# EAGLE board 11-de-7 (EAGLE 6.6.0)
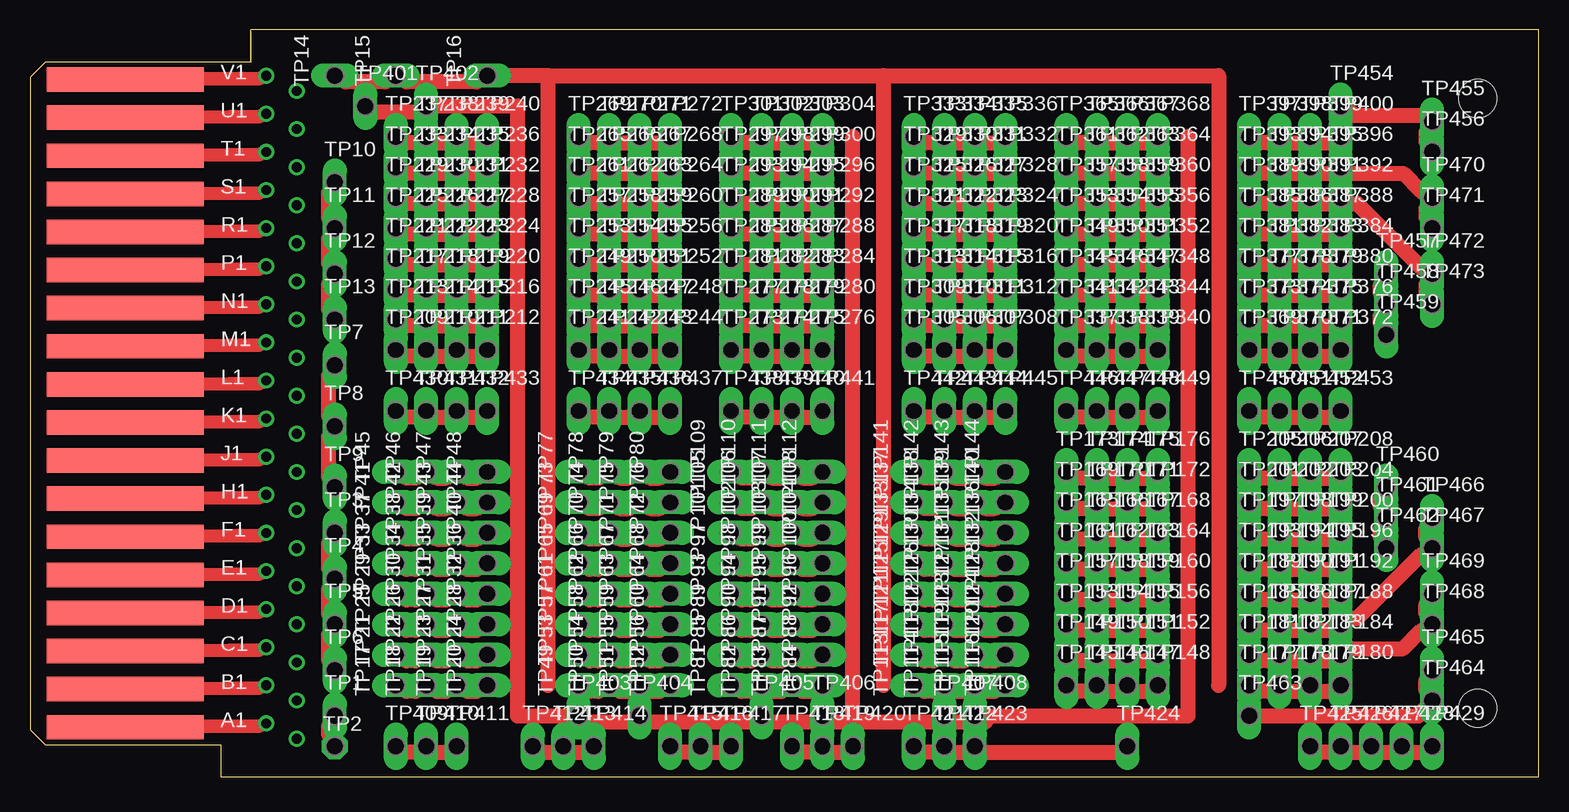
[diagram p1: board, top side]
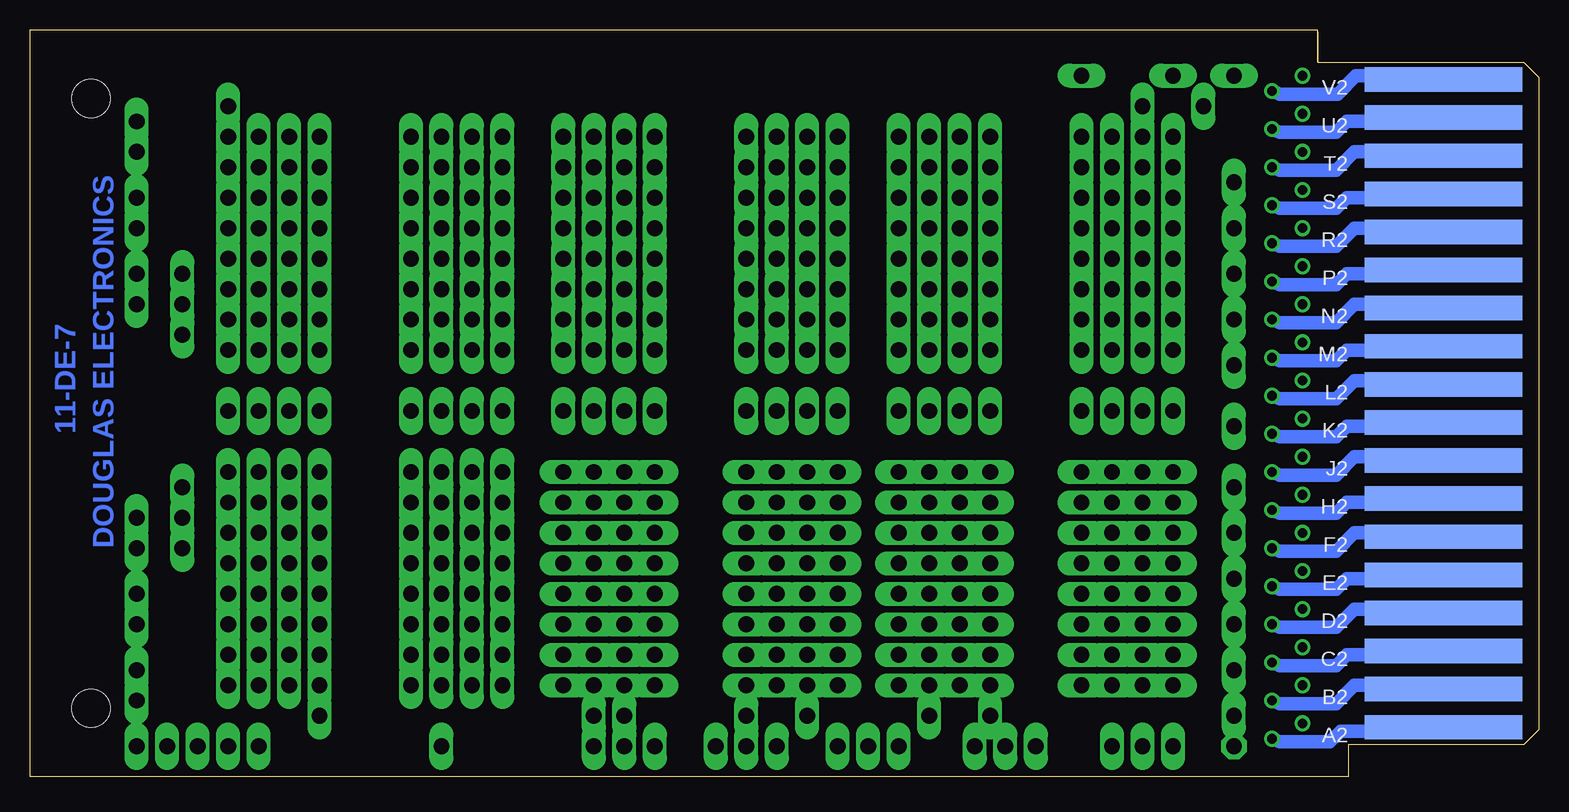
[diagram p2: board, bottom side, seen from below]

Size 125.73 x 62.23 mm. Coordinates in mm from the lower left corner, seen from the top.
Copper layers (1+16): Top 0.035mm / dielectric 1.5mm / Bottom 0.035mm
Design rules "16mils": minimum track width 16mil, minimum drill 32mil, track to track 15mil, track to pad 10mil, pad to pad 10mil, via to via 10mil, smd to smd 10mil, copper to edge 13mil, drill to drill 10mil, minimum pad ring 10mil, minimum via ring 8mil, stop-mask expansion 0mil, vias tented up to drill 0mil, thermal gap 10mil
Net classes: 0 default: width 1.143 mm

## Footprints (pad centres in the part's own frame; a part is rotated, then mirrored left to right if it is on the bottom)
P1-13Y = drill 1.321 pad 1.905 long: TP 0,0
P1-13 = drill 1.321 pad 2.159 octagon: TP 0,0
EDGE-CON2 = smd 13.106 x 2.032: A1 7.938,4.128; B1 7.938,7.303; C1 7.938,10.477; D1 7.938,13.652; E1 7.938,16.828; F1 7.938,20.003; H1 7.938,23.177; J1 7.938,26.352; K1 7.938,29.527; L1 7.938,32.703; M1 7.938,35.877; N1 7.938,39.053; P1 7.938,42.227; R1 7.938,45.403; S1 7.938,48.578; T1 7.938,51.752; U1 7.938,54.928; V1 7.938,58.102 | smd 13.106 x 2.032 bottom: A2 7.938,4.128; B2 7.938,7.303; C2 7.938,10.477; D2 7.938,13.652; E2 7.938,16.828; F2 7.938,20.003; H2 7.938,23.177; J2 7.938,26.352; K2 7.938,29.527; L2 7.938,32.703; M2 7.938,35.877; N2 7.938,39.053; P2 7.938,42.227; R2 7.938,45.403; S2 7.938,48.578; T2 7.938,51.752; U2 7.938,54.928; V2 7.938,58.102
SINGLE = hole 3.175: 120.65,56.515; 120.65,5.715
THRU-HOLEC = drill 0.813 pad 1.27: A1 17.78,3.81; A2 20.32,2.54; B1 17.78,6.985; B2 20.32,5.715; C1 17.78,10.16; C2 20.32,8.89; D1 17.78,13.335; D2 20.32,12.065; E1 17.78,16.51; E2 20.32,15.24; F1 17.78,19.685; F2 20.32,18.415; H1 17.78,22.86; H2 20.32,21.59; J1 17.78,26.035; J2 20.32,24.765; K1 17.78,29.21; K2 20.32,27.94; L1 17.78,32.385; L2 20.32,31.115; M1 17.78,35.56; M2 20.32,34.29; N1 17.78,38.735; N2 20.32,37.465; P1 17.78,41.91; P2 20.32,40.64; R1 17.78,45.085; R2 20.32,43.815; S1 17.78,48.26; S2 20.32,46.99; T1 17.78,51.435; T2 20.32,50.165; U1 17.78,54.61; U2 20.32,53.34; V1 17.78,57.785; V2 20.32,56.515

## Placement (x,y rotation side)
TP1  TPPAD1-13Y  [P1-13Y]  25.4,5.08 0 top
TP2  TPPAD1-13  [P1-13]  25.4,2.54 0 top
TP3  TPPAD1-13Y  [P1-13Y]  25.4,20.32 0 top
TP4  TPPAD1-13Y  [P1-13Y]  25.4,16.51 0 top
TP5  TPPAD1-13Y  [P1-13Y]  25.4,12.7 0 top
TP6  TPPAD1-13Y  [P1-13Y]  25.4,8.89 0 top
TP7  TPPAD1-13Y  [P1-13Y]  25.4,34.29 0 top
TP8  TPPAD1-13Y  [P1-13Y]  25.4,29.21 0 top
TP9  TPPAD1-13Y  [P1-13Y]  25.4,24.13 0 top
TP10  TPPAD1-13Y  [P1-13Y]  25.4,49.53 0 top
TP11  TPPAD1-13Y  [P1-13Y]  25.4,45.72 0 top
TP12  TPPAD1-13Y  [P1-13Y]  25.4,41.91 0 top
TP13  TPPAD1-13Y  [P1-13Y]  25.4,38.1 0 top
TP14  TPPAD1-13Y  [P1-13Y]  25.4,58.42 90 top
TP15  TPPAD1-13Y  [P1-13Y]  30.48,58.42 90 top
TP16  TPPAD1-13Y  [P1-13Y]  38.1,58.42 90 top
TP17  TPPAD1-13Y  [P1-13Y]  30.48,7.62 90 top
TP18  TPPAD1-13Y  [P1-13Y]  33.02,7.62 90 top
TP19  TPPAD1-13Y  [P1-13Y]  35.56,7.62 90 top
TP20  TPPAD1-13Y  [P1-13Y]  38.1,7.62 90 top
TP21  TPPAD1-13Y  [P1-13Y]  30.48,10.16 90 top
TP22  TPPAD1-13Y  [P1-13Y]  33.02,10.16 90 top
TP23  TPPAD1-13Y  [P1-13Y]  35.56,10.16 90 top
TP24  TPPAD1-13Y  [P1-13Y]  38.1,10.16 90 top
TP25  TPPAD1-13Y  [P1-13Y]  30.48,12.7 90 top
TP26  TPPAD1-13Y  [P1-13Y]  33.02,12.7 90 top
TP27  TPPAD1-13Y  [P1-13Y]  35.56,12.7 90 top
TP28  TPPAD1-13Y  [P1-13Y]  38.1,12.7 90 top
TP29  TPPAD1-13Y  [P1-13Y]  30.48,15.24 90 top
TP30  TPPAD1-13Y  [P1-13Y]  33.02,15.24 90 top
TP31  TPPAD1-13Y  [P1-13Y]  35.56,15.24 90 top
TP32  TPPAD1-13Y  [P1-13Y]  38.1,15.24 90 top
TP33  TPPAD1-13Y  [P1-13Y]  30.48,17.78 90 top
TP34  TPPAD1-13Y  [P1-13Y]  33.02,17.78 90 top
TP35  TPPAD1-13Y  [P1-13Y]  35.56,17.78 90 top
TP36  TPPAD1-13Y  [P1-13Y]  38.1,17.78 90 top
TP37  TPPAD1-13Y  [P1-13Y]  30.48,20.32 90 top
TP38  TPPAD1-13Y  [P1-13Y]  33.02,20.32 90 top
TP39  TPPAD1-13Y  [P1-13Y]  35.56,20.32 90 top
TP40  TPPAD1-13Y  [P1-13Y]  38.1,20.32 90 top
TP41  TPPAD1-13Y  [P1-13Y]  30.48,22.86 90 top
TP42  TPPAD1-13Y  [P1-13Y]  33.02,22.86 90 top
TP43  TPPAD1-13Y  [P1-13Y]  35.56,22.86 90 top
TP44  TPPAD1-13Y  [P1-13Y]  38.1,22.86 90 top
TP45  TPPAD1-13Y  [P1-13Y]  30.48,25.4 90 top
TP46  TPPAD1-13Y  [P1-13Y]  33.02,25.4 90 top
TP47  TPPAD1-13Y  [P1-13Y]  35.56,25.4 90 top
TP48  TPPAD1-13Y  [P1-13Y]  38.1,25.4 90 top
TP49  TPPAD1-13Y  [P1-13Y]  45.72,7.62 90 top
TP50  TPPAD1-13Y  [P1-13Y]  48.26,7.62 90 top
TP51  TPPAD1-13Y  [P1-13Y]  50.8,7.62 90 top
TP52  TPPAD1-13Y  [P1-13Y]  53.34,7.62 90 top
TP53  TPPAD1-13Y  [P1-13Y]  45.72,10.16 90 top
TP54  TPPAD1-13Y  [P1-13Y]  48.26,10.16 90 top
TP55  TPPAD1-13Y  [P1-13Y]  50.8,10.16 90 top
TP56  TPPAD1-13Y  [P1-13Y]  53.34,10.16 90 top
TP57  TPPAD1-13Y  [P1-13Y]  45.72,12.7 90 top
TP58  TPPAD1-13Y  [P1-13Y]  48.26,12.7 90 top
TP59  TPPAD1-13Y  [P1-13Y]  50.8,12.7 90 top
TP60  TPPAD1-13Y  [P1-13Y]  53.34,12.7 90 top
TP61  TPPAD1-13Y  [P1-13Y]  45.72,15.24 90 top
TP62  TPPAD1-13Y  [P1-13Y]  48.26,15.24 90 top
TP63  TPPAD1-13Y  [P1-13Y]  50.8,15.24 90 top
TP64  TPPAD1-13Y  [P1-13Y]  53.34,15.24 90 top
TP65  TPPAD1-13Y  [P1-13Y]  45.72,17.78 90 top
TP66  TPPAD1-13Y  [P1-13Y]  48.26,17.78 90 top
TP67  TPPAD1-13Y  [P1-13Y]  50.8,17.78 90 top
TP68  TPPAD1-13Y  [P1-13Y]  53.34,17.78 90 top
TP69  TPPAD1-13Y  [P1-13Y]  45.72,20.32 90 top
TP70  TPPAD1-13Y  [P1-13Y]  48.26,20.32 90 top
TP71  TPPAD1-13Y  [P1-13Y]  50.8,20.32 90 top
TP72  TPPAD1-13Y  [P1-13Y]  53.34,20.32 90 top
TP73  TPPAD1-13Y  [P1-13Y]  45.72,22.86 90 top
TP74  TPPAD1-13Y  [P1-13Y]  48.26,22.86 90 top
TP75  TPPAD1-13Y  [P1-13Y]  50.8,22.86 90 top
TP76  TPPAD1-13Y  [P1-13Y]  53.34,22.86 90 top
TP77  TPPAD1-13Y  [P1-13Y]  45.72,25.4 90 top
TP78  TPPAD1-13Y  [P1-13Y]  48.26,25.4 90 top
TP79  TPPAD1-13Y  [P1-13Y]  50.8,25.4 90 top
TP80  TPPAD1-13Y  [P1-13Y]  53.34,25.4 90 top
TP81  TPPAD1-13Y  [P1-13Y]  58.42,7.62 90 top
TP82  TPPAD1-13Y  [P1-13Y]  60.96,7.62 90 top
TP83  TPPAD1-13Y  [P1-13Y]  63.5,7.62 90 top
TP84  TPPAD1-13Y  [P1-13Y]  66.04,7.62 90 top
TP85  TPPAD1-13Y  [P1-13Y]  58.42,10.16 90 top
TP86  TPPAD1-13Y  [P1-13Y]  60.96,10.16 90 top
TP87  TPPAD1-13Y  [P1-13Y]  63.5,10.16 90 top
TP88  TPPAD1-13Y  [P1-13Y]  66.04,10.16 90 top
TP89  TPPAD1-13Y  [P1-13Y]  58.42,12.7 90 top
TP90  TPPAD1-13Y  [P1-13Y]  60.96,12.7 90 top
TP91  TPPAD1-13Y  [P1-13Y]  63.5,12.7 90 top
TP92  TPPAD1-13Y  [P1-13Y]  66.04,12.7 90 top
TP93  TPPAD1-13Y  [P1-13Y]  58.42,15.24 90 top
TP94  TPPAD1-13Y  [P1-13Y]  60.96,15.24 90 top
TP95  TPPAD1-13Y  [P1-13Y]  63.5,15.24 90 top
TP96  TPPAD1-13Y  [P1-13Y]  66.04,15.24 90 top
TP97  TPPAD1-13Y  [P1-13Y]  58.42,17.78 90 top
TP98  TPPAD1-13Y  [P1-13Y]  60.96,17.78 90 top
TP99  TPPAD1-13Y  [P1-13Y]  63.5,17.78 90 top
TP100  TPPAD1-13Y  [P1-13Y]  66.04,17.78 90 top
TP101  TPPAD1-13Y  [P1-13Y]  58.42,20.32 90 top
TP102  TPPAD1-13Y  [P1-13Y]  60.96,20.32 90 top
TP103  TPPAD1-13Y  [P1-13Y]  63.5,20.32 90 top
TP104  TPPAD1-13Y  [P1-13Y]  66.04,20.32 90 top
TP105  TPPAD1-13Y  [P1-13Y]  58.42,22.86 90 top
TP106  TPPAD1-13Y  [P1-13Y]  60.96,22.86 90 top
TP107  TPPAD1-13Y  [P1-13Y]  63.5,22.86 90 top
TP108  TPPAD1-13Y  [P1-13Y]  66.04,22.86 90 top
TP109  TPPAD1-13Y  [P1-13Y]  58.42,25.4 90 top
TP110  TPPAD1-13Y  [P1-13Y]  60.96,25.4 90 top
TP111  TPPAD1-13Y  [P1-13Y]  63.5,25.4 90 top
TP112  TPPAD1-13Y  [P1-13Y]  66.04,25.4 90 top
TP113  TPPAD1-13Y  [P1-13Y]  73.66,7.62 90 top
TP114  TPPAD1-13Y  [P1-13Y]  76.2,7.62 90 top
TP115  TPPAD1-13Y  [P1-13Y]  78.74,7.62 90 top
TP116  TPPAD1-13Y  [P1-13Y]  81.28,7.62 90 top
TP117  TPPAD1-13Y  [P1-13Y]  73.66,10.16 90 top
TP118  TPPAD1-13Y  [P1-13Y]  76.2,10.16 90 top
TP119  TPPAD1-13Y  [P1-13Y]  78.74,10.16 90 top
TP120  TPPAD1-13Y  [P1-13Y]  81.28,10.16 90 top
TP121  TPPAD1-13Y  [P1-13Y]  73.66,12.7 90 top
TP122  TPPAD1-13Y  [P1-13Y]  76.2,12.7 90 top
TP123  TPPAD1-13Y  [P1-13Y]  78.74,12.7 90 top
TP124  TPPAD1-13Y  [P1-13Y]  81.28,12.7 90 top
TP125  TPPAD1-13Y  [P1-13Y]  73.66,15.24 90 top
TP126  TPPAD1-13Y  [P1-13Y]  76.2,15.24 90 top
TP127  TPPAD1-13Y  [P1-13Y]  78.74,15.24 90 top
TP128  TPPAD1-13Y  [P1-13Y]  81.28,15.24 90 top
TP129  TPPAD1-13Y  [P1-13Y]  73.66,17.78 90 top
TP130  TPPAD1-13Y  [P1-13Y]  76.2,17.78 90 top
TP131  TPPAD1-13Y  [P1-13Y]  78.74,17.78 90 top
TP132  TPPAD1-13Y  [P1-13Y]  81.28,17.78 90 top
TP133  TPPAD1-13Y  [P1-13Y]  73.66,20.32 90 top
TP134  TPPAD1-13Y  [P1-13Y]  76.2,20.32 90 top
TP135  TPPAD1-13Y  [P1-13Y]  78.74,20.32 90 top
TP136  TPPAD1-13Y  [P1-13Y]  81.28,20.32 90 top
TP137  TPPAD1-13Y  [P1-13Y]  73.66,22.86 90 top
TP138  TPPAD1-13Y  [P1-13Y]  76.2,22.86 90 top
TP139  TPPAD1-13Y  [P1-13Y]  78.74,22.86 90 top
TP140  TPPAD1-13Y  [P1-13Y]  81.28,22.86 90 top
TP141  TPPAD1-13Y  [P1-13Y]  73.66,25.4 90 top
TP142  TPPAD1-13Y  [P1-13Y]  76.2,25.4 90 top
TP143  TPPAD1-13Y  [P1-13Y]  78.74,25.4 90 top
TP144  TPPAD1-13Y  [P1-13Y]  81.28,25.4 90 top
TP145  TPPAD1-13Y  [P1-13Y]  86.36,7.62 0 top
TP146  TPPAD1-13Y  [P1-13Y]  88.9,7.62 0 top
TP147  TPPAD1-13Y  [P1-13Y]  91.44,7.62 0 top
TP148  TPPAD1-13Y  [P1-13Y]  93.98,7.62 0 top
TP149  TPPAD1-13Y  [P1-13Y]  86.36,10.16 0 top
TP150  TPPAD1-13Y  [P1-13Y]  88.9,10.16 0 top
TP151  TPPAD1-13Y  [P1-13Y]  91.44,10.16 0 top
TP152  TPPAD1-13Y  [P1-13Y]  93.98,10.16 0 top
TP153  TPPAD1-13Y  [P1-13Y]  86.36,12.7 0 top
TP154  TPPAD1-13Y  [P1-13Y]  88.9,12.7 0 top
TP155  TPPAD1-13Y  [P1-13Y]  91.44,12.7 0 top
TP156  TPPAD1-13Y  [P1-13Y]  93.98,12.7 0 top
TP157  TPPAD1-13Y  [P1-13Y]  86.36,15.24 0 top
TP158  TPPAD1-13Y  [P1-13Y]  88.9,15.24 0 top
TP159  TPPAD1-13Y  [P1-13Y]  91.44,15.24 0 top
TP160  TPPAD1-13Y  [P1-13Y]  93.98,15.24 0 top
TP161  TPPAD1-13Y  [P1-13Y]  86.36,17.78 0 top
TP162  TPPAD1-13Y  [P1-13Y]  88.9,17.78 0 top
TP163  TPPAD1-13Y  [P1-13Y]  91.44,17.78 0 top
TP164  TPPAD1-13Y  [P1-13Y]  93.98,17.78 0 top
TP165  TPPAD1-13Y  [P1-13Y]  86.36,20.32 0 top
TP166  TPPAD1-13Y  [P1-13Y]  88.9,20.32 0 top
TP167  TPPAD1-13Y  [P1-13Y]  91.44,20.32 0 top
TP168  TPPAD1-13Y  [P1-13Y]  93.98,20.32 0 top
TP169  TPPAD1-13Y  [P1-13Y]  86.36,22.86 0 top
TP170  TPPAD1-13Y  [P1-13Y]  88.9,22.86 0 top
TP171  TPPAD1-13Y  [P1-13Y]  91.44,22.86 0 top
TP172  TPPAD1-13Y  [P1-13Y]  93.98,22.86 0 top
TP173  TPPAD1-13Y  [P1-13Y]  86.36,25.4 0 top
TP174  TPPAD1-13Y  [P1-13Y]  88.9,25.4 0 top
TP175  TPPAD1-13Y  [P1-13Y]  91.44,25.4 0 top
TP176  TPPAD1-13Y  [P1-13Y]  93.98,25.4 0 top
TP177  TPPAD1-13Y  [P1-13Y]  101.6,7.62 0 top
TP178  TPPAD1-13Y  [P1-13Y]  104.14,7.62 0 top
TP179  TPPAD1-13Y  [P1-13Y]  106.68,7.62 0 top
TP180  TPPAD1-13Y  [P1-13Y]  109.22,7.62 0 top
TP181  TPPAD1-13Y  [P1-13Y]  101.6,10.16 0 top
TP182  TPPAD1-13Y  [P1-13Y]  104.14,10.16 0 top
TP183  TPPAD1-13Y  [P1-13Y]  106.68,10.16 0 top
TP184  TPPAD1-13Y  [P1-13Y]  109.22,10.16 0 top
TP185  TPPAD1-13Y  [P1-13Y]  101.6,12.7 0 top
TP186  TPPAD1-13Y  [P1-13Y]  104.14,12.7 0 top
TP187  TPPAD1-13Y  [P1-13Y]  106.68,12.7 0 top
TP188  TPPAD1-13Y  [P1-13Y]  109.22,12.7 0 top
TP189  TPPAD1-13Y  [P1-13Y]  101.6,15.24 0 top
TP190  TPPAD1-13Y  [P1-13Y]  104.14,15.24 0 top
TP191  TPPAD1-13Y  [P1-13Y]  106.68,15.24 0 top
TP192  TPPAD1-13Y  [P1-13Y]  109.22,15.24 0 top
TP193  TPPAD1-13Y  [P1-13Y]  101.6,17.78 0 top
TP194  TPPAD1-13Y  [P1-13Y]  104.14,17.78 0 top
TP195  TPPAD1-13Y  [P1-13Y]  106.68,17.78 0 top
TP196  TPPAD1-13Y  [P1-13Y]  109.22,17.78 0 top
TP197  TPPAD1-13Y  [P1-13Y]  101.6,20.32 0 top
TP198  TPPAD1-13Y  [P1-13Y]  104.14,20.32 0 top
TP199  TPPAD1-13Y  [P1-13Y]  106.68,20.32 0 top
TP200  TPPAD1-13Y  [P1-13Y]  109.22,20.32 0 top
TP201  TPPAD1-13Y  [P1-13Y]  101.6,22.86 0 top
TP202  TPPAD1-13Y  [P1-13Y]  104.14,22.86 0 top
TP203  TPPAD1-13Y  [P1-13Y]  106.68,22.86 0 top
TP204  TPPAD1-13Y  [P1-13Y]  109.22,22.86 0 top
TP205  TPPAD1-13Y  [P1-13Y]  101.6,25.4 0 top
TP206  TPPAD1-13Y  [P1-13Y]  104.14,25.4 0 top
TP207  TPPAD1-13Y  [P1-13Y]  106.68,25.4 0 top
TP208  TPPAD1-13Y  [P1-13Y]  109.22,25.4 0 top
TP209  TPPAD1-13Y  [P1-13Y]  30.48,35.56 0 top
TP210  TPPAD1-13Y  [P1-13Y]  33.02,35.56 0 top
TP211  TPPAD1-13Y  [P1-13Y]  35.56,35.56 0 top
TP212  TPPAD1-13Y  [P1-13Y]  38.1,35.56 0 top
TP213  TPPAD1-13Y  [P1-13Y]  30.48,38.1 0 top
TP214  TPPAD1-13Y  [P1-13Y]  33.02,38.1 0 top
TP215  TPPAD1-13Y  [P1-13Y]  35.56,38.1 0 top
TP216  TPPAD1-13Y  [P1-13Y]  38.1,38.1 0 top
TP217  TPPAD1-13Y  [P1-13Y]  30.48,40.64 0 top
TP218  TPPAD1-13Y  [P1-13Y]  33.02,40.64 0 top
TP219  TPPAD1-13Y  [P1-13Y]  35.56,40.64 0 top
TP220  TPPAD1-13Y  [P1-13Y]  38.1,40.64 0 top
TP221  TPPAD1-13Y  [P1-13Y]  30.48,43.18 0 top
TP222  TPPAD1-13Y  [P1-13Y]  33.02,43.18 0 top
TP223  TPPAD1-13Y  [P1-13Y]  35.56,43.18 0 top
TP224  TPPAD1-13Y  [P1-13Y]  38.1,43.18 0 top
TP225  TPPAD1-13Y  [P1-13Y]  30.48,45.72 0 top
TP226  TPPAD1-13Y  [P1-13Y]  33.02,45.72 0 top
TP227  TPPAD1-13Y  [P1-13Y]  35.56,45.72 0 top
TP228  TPPAD1-13Y  [P1-13Y]  38.1,45.72 0 top
TP229  TPPAD1-13Y  [P1-13Y]  30.48,48.26 0 top
TP230  TPPAD1-13Y  [P1-13Y]  33.02,48.26 0 top
TP231  TPPAD1-13Y  [P1-13Y]  35.56,48.26 0 top
TP232  TPPAD1-13Y  [P1-13Y]  38.1,48.26 0 top
TP233  TPPAD1-13Y  [P1-13Y]  30.48,50.8 0 top
TP234  TPPAD1-13Y  [P1-13Y]  33.02,50.8 0 top
TP235  TPPAD1-13Y  [P1-13Y]  35.56,50.8 0 top
TP236  TPPAD1-13Y  [P1-13Y]  38.1,50.8 0 top
TP237  TPPAD1-13Y  [P1-13Y]  30.48,53.34 0 top
TP238  TPPAD1-13Y  [P1-13Y]  33.02,53.34 0 top
TP239  TPPAD1-13Y  [P1-13Y]  35.56,53.34 0 top
TP240  TPPAD1-13Y  [P1-13Y]  38.1,53.34 0 top
TP241  TPPAD1-13Y  [P1-13Y]  45.72,35.56 0 top
TP242  TPPAD1-13Y  [P1-13Y]  48.26,35.56 0 top
TP243  TPPAD1-13Y  [P1-13Y]  50.8,35.56 0 top
TP244  TPPAD1-13Y  [P1-13Y]  53.34,35.56 0 top
TP245  TPPAD1-13Y  [P1-13Y]  45.72,38.1 0 top
TP246  TPPAD1-13Y  [P1-13Y]  48.26,38.1 0 top
TP247  TPPAD1-13Y  [P1-13Y]  50.8,38.1 0 top
TP248  TPPAD1-13Y  [P1-13Y]  53.34,38.1 0 top
TP249  TPPAD1-13Y  [P1-13Y]  45.72,40.64 0 top
TP250  TPPAD1-13Y  [P1-13Y]  48.26,40.64 0 top
TP251  TPPAD1-13Y  [P1-13Y]  50.8,40.64 0 top
TP252  TPPAD1-13Y  [P1-13Y]  53.34,40.64 0 top
TP253  TPPAD1-13Y  [P1-13Y]  45.72,43.18 0 top
TP254  TPPAD1-13Y  [P1-13Y]  48.26,43.18 0 top
TP255  TPPAD1-13Y  [P1-13Y]  50.8,43.18 0 top
TP256  TPPAD1-13Y  [P1-13Y]  53.34,43.18 0 top
TP257  TPPAD1-13Y  [P1-13Y]  45.72,45.72 0 top
TP258  TPPAD1-13Y  [P1-13Y]  48.26,45.72 0 top
TP259  TPPAD1-13Y  [P1-13Y]  50.8,45.72 0 top
TP260  TPPAD1-13Y  [P1-13Y]  53.34,45.72 0 top
TP261  TPPAD1-13Y  [P1-13Y]  45.72,48.26 0 top
TP262  TPPAD1-13Y  [P1-13Y]  48.26,48.26 0 top
TP263  TPPAD1-13Y  [P1-13Y]  50.8,48.26 0 top
TP264  TPPAD1-13Y  [P1-13Y]  53.34,48.26 0 top
TP265  TPPAD1-13Y  [P1-13Y]  45.72,50.8 0 top
TP266  TPPAD1-13Y  [P1-13Y]  48.26,50.8 0 top
TP267  TPPAD1-13Y  [P1-13Y]  50.8,50.8 0 top
TP268  TPPAD1-13Y  [P1-13Y]  53.34,50.8 0 top
TP269  TPPAD1-13Y  [P1-13Y]  45.72,53.34 0 top
TP270  TPPAD1-13Y  [P1-13Y]  48.26,53.34 0 top
TP271  TPPAD1-13Y  [P1-13Y]  50.8,53.34 0 top
TP272  TPPAD1-13Y  [P1-13Y]  53.34,53.34 0 top
TP273  TPPAD1-13Y  [P1-13Y]  58.42,35.56 0 top
TP274  TPPAD1-13Y  [P1-13Y]  60.96,35.56 0 top
TP275  TPPAD1-13Y  [P1-13Y]  63.5,35.56 0 top
TP276  TPPAD1-13Y  [P1-13Y]  66.04,35.56 0 top
TP277  TPPAD1-13Y  [P1-13Y]  58.42,38.1 0 top
TP278  TPPAD1-13Y  [P1-13Y]  60.96,38.1 0 top
TP279  TPPAD1-13Y  [P1-13Y]  63.5,38.1 0 top
TP280  TPPAD1-13Y  [P1-13Y]  66.04,38.1 0 top
TP281  TPPAD1-13Y  [P1-13Y]  58.42,40.64 0 top
TP282  TPPAD1-13Y  [P1-13Y]  60.96,40.64 0 top
TP283  TPPAD1-13Y  [P1-13Y]  63.5,40.64 0 top
TP284  TPPAD1-13Y  [P1-13Y]  66.04,40.64 0 top
TP285  TPPAD1-13Y  [P1-13Y]  58.42,43.18 0 top
TP286  TPPAD1-13Y  [P1-13Y]  60.96,43.18 0 top
TP287  TPPAD1-13Y  [P1-13Y]  63.5,43.18 0 top
TP288  TPPAD1-13Y  [P1-13Y]  66.04,43.18 0 top
TP289  TPPAD1-13Y  [P1-13Y]  58.42,45.72 0 top
TP290  TPPAD1-13Y  [P1-13Y]  60.96,45.72 0 top
TP291  TPPAD1-13Y  [P1-13Y]  63.5,45.72 0 top
TP292  TPPAD1-13Y  [P1-13Y]  66.04,45.72 0 top
TP293  TPPAD1-13Y  [P1-13Y]  58.42,48.26 0 top
TP294  TPPAD1-13Y  [P1-13Y]  60.96,48.26 0 top
TP295  TPPAD1-13Y  [P1-13Y]  63.5,48.26 0 top
TP296  TPPAD1-13Y  [P1-13Y]  66.04,48.26 0 top
TP297  TPPAD1-13Y  [P1-13Y]  58.42,50.8 0 top
TP298  TPPAD1-13Y  [P1-13Y]  60.96,50.8 0 top
TP299  TPPAD1-13Y  [P1-13Y]  63.5,50.8 0 top
TP300  TPPAD1-13Y  [P1-13Y]  66.04,50.8 0 top
TP301  TPPAD1-13Y  [P1-13Y]  58.42,53.34 0 top
TP302  TPPAD1-13Y  [P1-13Y]  60.96,53.34 0 top
TP303  TPPAD1-13Y  [P1-13Y]  63.5,53.34 0 top
TP304  TPPAD1-13Y  [P1-13Y]  66.04,53.34 0 top
TP305  TPPAD1-13Y  [P1-13Y]  73.66,35.56 0 top
TP306  TPPAD1-13Y  [P1-13Y]  76.2,35.56 0 top
TP307  TPPAD1-13Y  [P1-13Y]  78.74,35.56 0 top
TP308  TPPAD1-13Y  [P1-13Y]  81.28,35.56 0 top
TP309  TPPAD1-13Y  [P1-13Y]  73.66,38.1 0 top
TP310  TPPAD1-13Y  [P1-13Y]  76.2,38.1 0 top
TP311  TPPAD1-13Y  [P1-13Y]  78.74,38.1 0 top
TP312  TPPAD1-13Y  [P1-13Y]  81.28,38.1 0 top
TP313  TPPAD1-13Y  [P1-13Y]  73.66,40.64 0 top
TP314  TPPAD1-13Y  [P1-13Y]  76.2,40.64 0 top
TP315  TPPAD1-13Y  [P1-13Y]  78.74,40.64 0 top
TP316  TPPAD1-13Y  [P1-13Y]  81.28,40.64 0 top
TP317  TPPAD1-13Y  [P1-13Y]  73.66,43.18 0 top
TP318  TPPAD1-13Y  [P1-13Y]  76.2,43.18 0 top
TP319  TPPAD1-13Y  [P1-13Y]  78.74,43.18 0 top
TP320  TPPAD1-13Y  [P1-13Y]  81.28,43.18 0 top
TP321  TPPAD1-13Y  [P1-13Y]  73.66,45.72 0 top
TP322  TPPAD1-13Y  [P1-13Y]  76.2,45.72 0 top
TP323  TPPAD1-13Y  [P1-13Y]  78.74,45.72 0 top
TP324  TPPAD1-13Y  [P1-13Y]  81.28,45.72 0 top
TP325  TPPAD1-13Y  [P1-13Y]  73.66,48.26 0 top
TP326  TPPAD1-13Y  [P1-13Y]  76.2,48.26 0 top
TP327  TPPAD1-13Y  [P1-13Y]  78.74,48.26 0 top
TP328  TPPAD1-13Y  [P1-13Y]  81.28,48.26 0 top
TP329  TPPAD1-13Y  [P1-13Y]  73.66,50.8 0 top
TP330  TPPAD1-13Y  [P1-13Y]  76.2,50.8 0 top
TP331  TPPAD1-13Y  [P1-13Y]  78.74,50.8 0 top
TP332  TPPAD1-13Y  [P1-13Y]  81.28,50.8 0 top
TP333  TPPAD1-13Y  [P1-13Y]  73.66,53.34 0 top
TP334  TPPAD1-13Y  [P1-13Y]  76.2,53.34 0 top
TP335  TPPAD1-13Y  [P1-13Y]  78.74,53.34 0 top
TP336  TPPAD1-13Y  [P1-13Y]  81.28,53.34 0 top
TP337  TPPAD1-13Y  [P1-13Y]  86.36,35.56 0 top
TP338  TPPAD1-13Y  [P1-13Y]  88.9,35.56 0 top
TP339  TPPAD1-13Y  [P1-13Y]  91.44,35.56 0 top
TP340  TPPAD1-13Y  [P1-13Y]  93.98,35.56 0 top
TP341  TPPAD1-13Y  [P1-13Y]  86.36,38.1 0 top
TP342  TPPAD1-13Y  [P1-13Y]  88.9,38.1 0 top
TP343  TPPAD1-13Y  [P1-13Y]  91.44,38.1 0 top
TP344  TPPAD1-13Y  [P1-13Y]  93.98,38.1 0 top
TP345  TPPAD1-13Y  [P1-13Y]  86.36,40.64 0 top
TP346  TPPAD1-13Y  [P1-13Y]  88.9,40.64 0 top
TP347  TPPAD1-13Y  [P1-13Y]  91.44,40.64 0 top
TP348  TPPAD1-13Y  [P1-13Y]  93.98,40.64 0 top
TP349  TPPAD1-13Y  [P1-13Y]  86.36,43.18 0 top
TP350  TPPAD1-13Y  [P1-13Y]  88.9,43.18 0 top
TP351  TPPAD1-13Y  [P1-13Y]  91.44,43.18 0 top
TP352  TPPAD1-13Y  [P1-13Y]  93.98,43.18 0 top
TP353  TPPAD1-13Y  [P1-13Y]  86.36,45.72 0 top
TP354  TPPAD1-13Y  [P1-13Y]  88.9,45.72 0 top
TP355  TPPAD1-13Y  [P1-13Y]  91.44,45.72 0 top
TP356  TPPAD1-13Y  [P1-13Y]  93.98,45.72 0 top
TP357  TPPAD1-13Y  [P1-13Y]  86.36,48.26 0 top
TP358  TPPAD1-13Y  [P1-13Y]  88.9,48.26 0 top
TP359  TPPAD1-13Y  [P1-13Y]  91.44,48.26 0 top
TP360  TPPAD1-13Y  [P1-13Y]  93.98,48.26 0 top
TP361  TPPAD1-13Y  [P1-13Y]  86.36,50.8 0 top
TP362  TPPAD1-13Y  [P1-13Y]  88.9,50.8 0 top
TP363  TPPAD1-13Y  [P1-13Y]  91.44,50.8 0 top
TP364  TPPAD1-13Y  [P1-13Y]  93.98,50.8 0 top
TP365  TPPAD1-13Y  [P1-13Y]  86.36,53.34 0 top
TP366  TPPAD1-13Y  [P1-13Y]  88.9,53.34 0 top
TP367  TPPAD1-13Y  [P1-13Y]  91.44,53.34 0 top
TP368  TPPAD1-13Y  [P1-13Y]  93.98,53.34 0 top
TP369  TPPAD1-13Y  [P1-13Y]  101.6,35.56 0 top
TP370  TPPAD1-13Y  [P1-13Y]  104.14,35.56 0 top
TP371  TPPAD1-13Y  [P1-13Y]  106.68,35.56 0 top
TP372  TPPAD1-13Y  [P1-13Y]  109.22,35.56 0 top
TP373  TPPAD1-13Y  [P1-13Y]  101.6,38.1 0 top
TP374  TPPAD1-13Y  [P1-13Y]  104.14,38.1 0 top
TP375  TPPAD1-13Y  [P1-13Y]  106.68,38.1 0 top
TP376  TPPAD1-13Y  [P1-13Y]  109.22,38.1 0 top
TP377  TPPAD1-13Y  [P1-13Y]  101.6,40.64 0 top
TP378  TPPAD1-13Y  [P1-13Y]  104.14,40.64 0 top
TP379  TPPAD1-13Y  [P1-13Y]  106.68,40.64 0 top
TP380  TPPAD1-13Y  [P1-13Y]  109.22,40.64 0 top
TP381  TPPAD1-13Y  [P1-13Y]  101.6,43.18 0 top
TP382  TPPAD1-13Y  [P1-13Y]  104.14,43.18 0 top
TP383  TPPAD1-13Y  [P1-13Y]  106.68,43.18 0 top
TP384  TPPAD1-13Y  [P1-13Y]  109.22,43.18 0 top
TP385  TPPAD1-13Y  [P1-13Y]  101.6,45.72 0 top
TP386  TPPAD1-13Y  [P1-13Y]  104.14,45.72 0 top
TP387  TPPAD1-13Y  [P1-13Y]  106.68,45.72 0 top
TP388  TPPAD1-13Y  [P1-13Y]  109.22,45.72 0 top
TP389  TPPAD1-13Y  [P1-13Y]  101.6,48.26 0 top
TP390  TPPAD1-13Y  [P1-13Y]  104.14,48.26 0 top
TP391  TPPAD1-13Y  [P1-13Y]  106.68,48.26 0 top
TP392  TPPAD1-13Y  [P1-13Y]  109.22,48.26 0 top
TP393  TPPAD1-13Y  [P1-13Y]  101.6,50.8 0 top
TP394  TPPAD1-13Y  [P1-13Y]  104.14,50.8 0 top
TP395  TPPAD1-13Y  [P1-13Y]  106.68,50.8 0 top
TP396  TPPAD1-13Y  [P1-13Y]  109.22,50.8 0 top
TP397  TPPAD1-13Y  [P1-13Y]  101.6,53.34 0 top
TP398  TPPAD1-13Y  [P1-13Y]  104.14,53.34 0 top
TP399  TPPAD1-13Y  [P1-13Y]  106.68,53.34 0 top
TP400  TPPAD1-13Y  [P1-13Y]  109.22,53.34 0 top
TP401  TPPAD1-13Y  [P1-13Y]  27.94,55.88 0 top
TP402  TPPAD1-13Y  [P1-13Y]  33.02,55.88 0 top
TP403  TPPAD1-13Y  [P1-13Y]  45.72,5.08 0 top
TP404  TPPAD1-13Y  [P1-13Y]  50.8,5.08 0 top
TP405  TPPAD1-13Y  [P1-13Y]  60.96,5.08 0 top
TP406  TPPAD1-13Y  [P1-13Y]  66.04,5.08 0 top
TP407  TPPAD1-13Y  [P1-13Y]  76.2,5.08 0 top
TP408  TPPAD1-13Y  [P1-13Y]  78.74,5.08 0 top
TP409  TPPAD1-13Y  [P1-13Y]  30.48,2.54 0 top
TP410  TPPAD1-13Y  [P1-13Y]  33.02,2.54 0 top
TP411  TPPAD1-13Y  [P1-13Y]  35.56,2.54 0 top
TP412  TPPAD1-13Y  [P1-13Y]  41.91,2.54 0 top
TP413  TPPAD1-13Y  [P1-13Y]  44.45,2.54 0 top
TP414  TPPAD1-13Y  [P1-13Y]  46.99,2.54 0 top
TP415  TPPAD1-13Y  [P1-13Y]  53.34,2.54 0 top
TP416  TPPAD1-13Y  [P1-13Y]  55.88,2.54 0 top
TP417  TPPAD1-13Y  [P1-13Y]  58.42,2.54 0 top
TP418  TPPAD1-13Y  [P1-13Y]  63.5,2.54 0 top
TP419  TPPAD1-13Y  [P1-13Y]  66.04,2.54 0 top
TP420  TPPAD1-13Y  [P1-13Y]  68.58,2.54 0 top
TP421  TPPAD1-13Y  [P1-13Y]  73.66,2.54 0 top
TP422  TPPAD1-13Y  [P1-13Y]  76.2,2.54 0 top
TP423  TPPAD1-13Y  [P1-13Y]  78.74,2.54 0 top
TP424  TPPAD1-13Y  [P1-13Y]  91.44,2.54 0 top
TP425  TPPAD1-13Y  [P1-13Y]  106.68,2.54 0 top
TP426  TPPAD1-13Y  [P1-13Y]  109.22,2.54 0 top
TP427  TPPAD1-13Y  [P1-13Y]  111.76,2.54 0 top
TP428  TPPAD1-13Y  [P1-13Y]  114.3,2.54 0 top
TP429  TPPAD1-13Y  [P1-13Y]  116.84,2.54 0 top
TP430  TPPAD1-13Y  [P1-13Y]  30.48,30.48 0 top
TP431  TPPAD1-13Y  [P1-13Y]  33.02,30.48 0 top
TP432  TPPAD1-13Y  [P1-13Y]  35.56,30.48 0 top
TP433  TPPAD1-13Y  [P1-13Y]  38.1,30.48 0 top
TP434  TPPAD1-13Y  [P1-13Y]  45.72,30.48 0 top
TP435  TPPAD1-13Y  [P1-13Y]  48.26,30.48 0 top
TP436  TPPAD1-13Y  [P1-13Y]  50.8,30.48 0 top
TP437  TPPAD1-13Y  [P1-13Y]  53.34,30.48 0 top
TP438  TPPAD1-13Y  [P1-13Y]  58.42,30.48 0 top
TP439  TPPAD1-13Y  [P1-13Y]  60.96,30.48 0 top
TP440  TPPAD1-13Y  [P1-13Y]  63.5,30.48 0 top
TP441  TPPAD1-13Y  [P1-13Y]  66.04,30.48 0 top
TP442  TPPAD1-13Y  [P1-13Y]  73.66,30.48 0 top
TP443  TPPAD1-13Y  [P1-13Y]  76.2,30.48 0 top
TP444  TPPAD1-13Y  [P1-13Y]  78.74,30.48 0 top
TP445  TPPAD1-13Y  [P1-13Y]  81.28,30.48 0 top
TP446  TPPAD1-13Y  [P1-13Y]  86.36,30.48 0 top
TP447  TPPAD1-13Y  [P1-13Y]  88.9,30.48 0 top
TP448  TPPAD1-13Y  [P1-13Y]  91.44,30.48 0 top
TP449  TPPAD1-13Y  [P1-13Y]  93.98,30.48 0 top
TP450  TPPAD1-13Y  [P1-13Y]  101.6,30.48 0 top
TP451  TPPAD1-13Y  [P1-13Y]  104.14,30.48 0 top
TP452  TPPAD1-13Y  [P1-13Y]  106.68,30.48 0 top
TP453  TPPAD1-13Y  [P1-13Y]  109.22,30.48 0 top
TP454  TPPAD1-13Y  [P1-13Y]  109.22,55.88 0 top
TP455  TPPAD1-13Y  [P1-13Y]  116.84,54.61 0 top
TP456  TPPAD1-13Y  [P1-13Y]  116.84,52.07 0 top
TP457  TPPAD1-13Y  [P1-13Y]  113.03,41.91 0 top
TP458  TPPAD1-13Y  [P1-13Y]  113.03,39.37 0 top
TP459  TPPAD1-13Y  [P1-13Y]  113.03,36.83 0 top
TP460  TPPAD1-13Y  [P1-13Y]  113.03,24.13 0 top
TP461  TPPAD1-13Y  [P1-13Y]  113.03,21.59 0 top
TP462  TPPAD1-13Y  [P1-13Y]  113.03,19.05 0 top
TP463  TPPAD1-13Y  [P1-13Y]  101.6,5.08 0 top
TP464  TPPAD1-13Y  [P1-13Y]  116.84,6.35 0 top
TP465  TPPAD1-13Y  [P1-13Y]  116.84,8.89 0 top
TP466  TPPAD1-13Y  [P1-13Y]  116.84,21.59 0 top
TP467  TPPAD1-13Y  [P1-13Y]  116.84,19.05 0 top
TP468  TPPAD1-13Y  [P1-13Y]  116.84,12.7 0 top
TP469  TPPAD1-13Y  [P1-13Y]  116.84,15.24 0 top
TP470  TPPAD1-13Y  [P1-13Y]  116.84,48.26 0 top
TP471  TPPAD1-13Y  [P1-13Y]  116.84,45.72 0 top
TP472  TPPAD1-13Y  [P1-13Y]  116.84,41.91 0 top
TP473  TPPAD1-13Y  [P1-13Y]  116.84,39.37 0 top
U$1  [EDGE-CON2]  0,0 0 top
U$3  OUTLINE-SINGLE  [SINGLE]  0,0 0 top
U$5  THRU-HOLE2C  [THRU-HOLEC]  1.91,0.64 0 top

## Tracks (layer width: path | path; a pad name or v marks a point on that pad's centre or on a via)
N$1
  Bottom 1.143: U$5.L2 21.59,31.5 16.89,31.5 15.37,33.02 13.97,33.02 U$1.L2
N$2
  Bottom 1.143: U$5.M2 21.59,34.67 16.89,34.67 16,35.56 13.97,35.56 U$1.M2
N$3
  Bottom 1.143: U$5.N2 21.59,37.85 16.89,37.85 15.37,39.37 13.97,39.37 U$1.N2
N$4
  Bottom 1.143: U$5.K2 21.59,28.32 16.89,28.32 16,29.21 13.97,29.21 U$1.K2
N$5
  Bottom 1.143: U$5.J2 21.59,25.15 16.89,25.15 15.37,26.67 13.97,26.67 U$1.J2
N$6
  Bottom 1.143: U$5.H2 21.59,21.97 16.89,21.97 16,22.86 13.97,22.86 U$1.H2
N$7
  Bottom 1.143: U$5.F2 21.59,18.8 16.89,18.8 15.37,20.32 13.97,20.32 U$1.F2
N$8
  Bottom 1.143: U$5.P2 21.59,41.02 16.89,41.02 16,41.91 13.97,41.91 U$1.P2
N$9
  Bottom 1.143: U$5.R2 21.59,44.2 16.89,44.2 15.37,45.72 13.97,45.72 U$1.R2
N$10
  Bottom 1.143: U$5.S2 21.59,47.37 16.89,47.37 16,48.26 13.97,48.26 U$1.S2
N$11
  Bottom 1.143: U$5.T2 21.59,50.55 16.89,50.55 15.37,52.07 13.97,52.07 U$1.T2
N$12
  Bottom 1.143: U$5.E2 21.59,15.62 16.89,15.62 16,16.51 13.97,16.51 U$1.E2
N$13
  Bottom 1.143: U$5.D2 21.59,12.45 16.89,12.45 15.37,13.97 13.97,13.97 U$1.D2
N$14
  Bottom 1.143: U$5.U2 21.59,53.72 16.89,53.72 16,54.61 13.97,54.61 U$1.U2
N$15
  Bottom 1.143: U$5.V2 21.59,56.9 16.76,56.9 15.24,58.42 13.97,58.42 U$1.V2
N$16
  Bottom 1.143: U$5.C2 21.59,9.27 16.89,9.27 16,10.16 13.97,10.16 U$1.C2
N$17
  Bottom 1.143: U$5.B2 21.59,6.1 16.89,6.1 15.37,7.62 13.97,7.62 U$1.B2
N$18
  Bottom 1.143: U$5.A2 21.59,2.92 17.4,2.92 16.51,3.81 14.1,3.81 U$1.A2
N$19
  Top 1.143: U$5.V1 19.05,58.17 14.1,58.17 U$1.V1
N$20
  Top 1.143: U$5.A1 19.05,4.19 14.1,4.19 U$1.A1
N$21
  Top 1.143: U$5.B1 19.05,7.37 16.64,7.37 U$1.B1
N$22
  Top 1.143: U$5.C1 19.05,10.54 16.64,10.54 U$1.C1
N$23
  Top 1.143: U$5.D1 19.05,13.72 16.64,13.72 U$1.D1
N$24
  Top 1.143: U$5.E1 19.05,16.89 16.64,16.89 U$1.E1
N$25
  Top 1.143: U$5.F1 19.05,20.07 16.64,20.07 U$1.F1
N$26
  Top 1.143: U$5.H1 19.05,23.24 16.64,23.24 U$1.H1
N$27
  Top 1.143: U$5.J1 19.05,26.42 16.64,26.42 U$1.J1
N$28
  Top 1.143: U$5.K1 19.05,29.59 16.64,29.59 U$1.K1
N$29
  Top 1.143: U$5.L1 19.05,32.77 16.64,32.77 U$1.L1
N$30
  Top 1.143: U$5.M1 19.05,35.94 16.64,35.94 U$1.M1
N$31
  Top 1.143: U$5.N1 19.05,39.12 16.64,39.12 U$1.N1
N$32
  Top 1.143: U$5.P1 19.05,42.29 16.64,42.29 U$1.P1
N$33
  Top 1.143: U$5.R1 19.05,45.47 16.64,45.47 U$1.R1
N$34
  Top 1.143: U$5.S1 19.05,48.64 16.64,48.64 U$1.S1
N$35
  Top 1.143: U$5.T1 19.05,51.82 16.64,51.82 U$1.T1
N$36
  Top 1.143: U$5.U1 19.05,54.99 16.64,54.99 U$1.U1
N$37
  Top 1.27: TP1.TP 24.89,4.19 24.89,3.56 TP2.TP
N$38
  Top 1.27: TP6.TP 24.89,9.78 24.89,11.81 TP5.TP 24.89,13.59 24.89,15.62 TP4.TP 24.89,17.4 24.89,19.43 TP3.TP
N$39
  Top 1.27: TP13.TP 24.89,38.99 24.89,41.02 TP12.TP 24.89,42.8 24.89,44.83 TP11.TP 24.89,46.61 24.89,48.64 TP10.TP
N$40
  Top 1.27: TP9.TP 24.89,25.02 24.89,28.32 TP8.TP 24.89,30.1 24.89,33.4 TP7.TP
N$41
  Top 1.27: TP14.TP 26.29,57.91 29.59,57.91 TP15.TP 31.37,57.91 37.21,57.91 TP16.TP 43.18,58.42 | 43.18,7.62 43.18,58.42 | 43.18,58.42 71.12,58.42 | 71.12,58.42 71.12,7.62 | 71.12,58.42 99.06,58.42 99.06,7.62
N$42
  Top 1.27: TP17.TP 31.37,7.11 32.13,7.11 TP18.TP 33.91,7.11 34.67,7.11 TP19.TP 36.45,7.11 37.21,7.11 TP20.TP
N$43
  Top 1.27: TP21.TP 31.37,9.65 32.13,9.65 TP22.TP 33.91,9.65 34.67,9.65 TP23.TP 36.45,9.65 37.21,9.65 TP24.TP
N$44
  Top 1.27: TP25.TP 31.37,12.19 32.13,12.19 TP26.TP 33.91,12.19 34.67,12.19 TP27.TP 36.45,12.19 37.21,12.19 TP28.TP
N$45
  Top 1.27: TP29.TP 31.37,14.73 32.13,14.73 TP30.TP 33.91,14.73 34.67,14.73 TP31.TP 36.45,14.73 37.21,14.73 TP32.TP
N$46
  Top 1.27: TP33.TP 31.37,17.27 32.13,17.27 TP34.TP 33.91,17.27 34.67,17.27 TP35.TP 36.45,17.27 37.21,17.27 TP36.TP
N$47
  Top 1.27: TP37.TP 31.37,19.81 32.13,19.81 TP38.TP 33.91,19.81 34.67,19.81 TP39.TP 36.45,19.81 37.21,19.81 TP40.TP
N$48
  Top 1.27: TP41.TP 31.37,22.35 32.13,22.35 TP42.TP 33.91,22.35 34.67,22.35 TP43.TP 36.45,22.35 37.21,22.35 TP44.TP
N$49
  Top 1.27: TP45.TP 31.37,24.89 32.13,24.89 TP46.TP 33.91,24.89 34.67,24.89 TP47.TP 36.45,24.89 37.21,24.89 TP48.TP
N$50
  Top 1.27: TP49.TP 46.61,7.11 47.37,7.11 TP50.TP 49.15,7.11 49.91,7.11 TP51.TP 51.69,7.11 52.45,7.11 TP52.TP
N$51
  Top 1.27: TP53.TP 46.61,9.65 47.37,9.65 TP54.TP 49.15,9.65 49.91,9.65 TP55.TP 51.69,9.65 52.45,9.65 TP56.TP
N$52
  Top 1.27: TP57.TP 46.61,12.19 47.37,12.19 TP58.TP 49.15,12.19 49.91,12.19 TP59.TP 51.69,12.19 52.45,12.19 TP60.TP
N$53
  Top 1.27: TP61.TP 46.61,14.73 47.37,14.73 TP62.TP 49.15,14.73 49.91,14.73 TP63.TP 51.69,14.73 52.45,14.73 TP64.TP
N$54
  Top 1.27: TP65.TP 46.61,17.27 47.37,17.27 TP66.TP 49.15,17.27 49.91,17.27 TP67.TP 51.69,17.27 52.45,17.27 TP68.TP
N$55
  Top 1.27: TP69.TP 46.61,19.81 47.37,19.81 TP70.TP 49.15,19.81 49.91,19.81 TP71.TP 51.69,19.81 52.45,19.81 TP72.TP
N$56
  Top 1.27: TP73.TP 46.61,22.35 47.37,22.35 TP74.TP 49.15,22.35 49.91,22.35 TP75.TP 51.69,22.35 52.45,22.35 TP76.TP
N$57
  Top 1.27: TP77.TP 46.61,24.89 47.37,24.89 TP78.TP 49.15,24.89 49.91,24.89 TP79.TP 51.69,24.89 52.45,24.89 TP80.TP
N$58
  Top 1.27: TP81.TP 59.31,7.11 60.07,7.11 TP82.TP 61.85,7.11 62.61,7.11 TP83.TP 64.39,7.11 65.15,7.11 TP84.TP
N$59
  Top 1.27: TP85.TP 59.31,9.65 60.07,9.65 TP86.TP 61.85,9.65 62.61,9.65 TP87.TP 64.39,9.65 65.15,9.65 TP88.TP
N$60
  Top 1.27: TP89.TP 59.31,12.19 60.07,12.19 TP90.TP 61.85,12.19 62.61,12.19 TP91.TP 64.39,12.19 65.15,12.19 TP92.TP
N$61
  Top 1.27: TP93.TP 59.31,14.73 60.07,14.73 TP94.TP 61.85,14.73 62.61,14.73 TP95.TP 64.39,14.73 65.15,14.73 TP96.TP
N$62
  Top 1.27: TP97.TP 59.31,17.27 60.07,17.27 TP98.TP 61.85,17.27 62.61,17.27 TP99.TP 64.39,17.27 65.15,17.27 TP100.TP
N$63
  Top 1.27: TP101.TP 59.31,19.81 60.07,19.81 TP102.TP 61.85,19.81 62.61,19.81 TP103.TP 64.39,19.81 65.15,19.81 TP104.TP
N$64
  Top 1.27: TP105.TP 59.31,22.35 60.07,22.35 TP106.TP 61.85,22.35 62.61,22.35 TP107.TP 64.39,22.35 65.15,22.35 TP108.TP
N$65
  Top 1.27: TP109.TP 59.31,24.89 60.07,24.89 TP110.TP 61.85,24.89 62.61,24.89 TP111.TP 64.39,24.89 65.15,24.89 TP112.TP
N$66
  Top 1.27: TP113.TP 74.55,7.11 75.31,7.11 TP114.TP 77.09,7.11 77.85,7.11 TP115.TP 79.63,7.11 80.39,7.11 TP116.TP
N$67
  Top 1.27: TP117.TP 74.55,9.65 75.31,9.65 TP118.TP 77.09,9.65 77.85,9.65 TP119.TP 79.63,9.65 80.39,9.65 TP120.TP
N$68
  Top 1.27: TP121.TP 74.55,12.19 75.31,12.19 TP122.TP 77.09,12.19 77.85,12.19 TP123.TP 79.63,12.19 80.39,12.19 TP124.TP
N$69
  Top 1.27: TP125.TP 74.55,14.73 75.31,14.73 TP126.TP 77.09,14.73 77.85,14.73 TP127.TP 79.63,14.73 80.39,14.73 TP128.TP
N$70
  Top 1.27: TP129.TP 74.55,17.27 75.31,17.27 TP130.TP 77.09,17.27 77.85,17.27 TP131.TP 79.63,17.27 80.39,17.27 TP132.TP
N$71
  Top 1.27: TP133.TP 74.55,19.81 75.31,19.81 TP134.TP 77.09,19.81 77.85,19.81 TP135.TP 79.63,19.81 80.39,19.81 TP136.TP
N$72
  Top 1.27: TP137.TP 74.55,22.35 75.31,22.35 TP138.TP 77.09,22.35 77.85,22.35 TP139.TP 79.63,22.35 80.39,22.35 TP140.TP
N$73
  Top 1.27: TP141.TP 74.55,24.89 75.31,24.89 TP142.TP 77.09,24.89 77.85,24.89 TP143.TP 79.63,24.89 80.39,24.89 TP144.TP
N$74
  Top 1.27: TP145.TP 87.25,7.11 88.01,7.11 TP146.TP 89.79,7.11 90.55,7.11 TP147.TP 92.33,7.11 93.09,7.11 TP148.TP
N$75
  Top 1.27: TP149.TP 87.25,9.65 88.01,9.65 TP150.TP 89.79,9.65 90.55,9.65 TP151.TP 92.33,9.65 93.09,9.65 TP152.TP
N$76
  Top 1.27: TP153.TP 87.25,12.19 88.01,12.19 TP154.TP 89.79,12.19 90.55,12.19 TP155.TP 92.33,12.19 93.09,12.19 TP156.TP
N$77
  Top 1.27: TP157.TP 87.25,14.73 88.01,14.73 TP158.TP 89.79,14.73 90.55,14.73 TP159.TP 92.33,14.73 93.09,14.73 TP160.TP
N$78
  Top 1.27: TP161.TP 87.25,17.27 88.01,17.27 TP162.TP 89.79,17.27 90.55,17.27 TP163.TP 92.33,17.27 93.09,17.27 TP164.TP
N$79
  Top 1.27: TP165.TP 87.25,19.81 88.01,19.81 TP166.TP 89.79,19.81 90.55,19.81 TP167.TP 92.33,19.81 93.09,19.81 TP168.TP
N$80
  Top 1.27: TP169.TP 87.25,22.35 88.01,22.35 TP170.TP 89.79,22.35 90.55,22.35 TP171.TP 92.33,22.35 93.09,22.35 TP172.TP
N$81
  Top 1.27: TP173.TP 87.25,24.89 88.01,24.89 TP174.TP 89.79,24.89 90.55,24.89 TP175.TP 92.33,24.89 93.09,24.89 TP176.TP
N$82
  Top 1.27: TP177.TP 102.49,7.11 103.25,7.11 TP178.TP 105.03,7.11 105.79,7.11 TP179.TP 107.57,7.11 108.33,7.11 TP180.TP
N$83
  Top 1.27: TP181.TP 102.49,9.65 103.25,9.65 TP182.TP 105.03,9.65 105.79,9.65 TP183.TP 107.57,9.65 108.33,9.65 TP184.TP 110.11,10.67 114.43,10.67 115.95,12.19 TP468.TP 116.33,13.59 116.33,14.35 TP469.TP
N$84
  Top 1.27: TP185.TP 102.49,12.19 103.25,12.19 TP186.TP 105.03,12.19 105.79,12.19 TP187.TP 107.57,12.19 108.33,12.19 TP188.TP 110.11,13.21 110.62,13.21 115.95,18.54 TP467.TP 116.33,19.94 116.33,20.7 TP466.TP
N$85
  Top 1.27: TP189.TP 102.49,14.73 103.25,14.73 TP190.TP 105.03,14.73 105.79,14.73 TP191.TP 107.57,14.73 108.33,14.73 TP192.TP
N$86
  Top 1.27: TP193.TP 102.49,17.27 103.25,17.27 TP194.TP 105.03,17.27 105.79,17.27 TP195.TP 107.57,17.27 108.33,17.27 TP196.TP
N$87
  Top 1.27: TP197.TP 102.49,19.81 103.25,19.81 TP198.TP 105.03,19.81 105.79,19.81 TP199.TP 107.57,19.81 108.33,19.81 TP200.TP
N$88
  Top 1.27: TP201.TP 102.49,22.35 103.25,22.35 TP202.TP 105.03,22.35 105.79,22.35 TP203.TP 107.57,22.35 108.33,22.35 TP204.TP
N$89
  Top 1.27: TP205.TP 102.49,24.89 103.25,24.89 TP206.TP 105.03,24.89 105.79,24.89 TP207.TP 107.57,24.89 108.33,24.89 TP208.TP
N$90
  Top 1.27: TP209.TP 31.37,35.05 32.13,35.05 TP210.TP 33.91,35.05 34.67,35.05 TP211.TP 36.45,35.05 37.21,35.05 TP212.TP
N$91
  Top 1.27: TP213.TP 31.37,37.59 32.13,37.59 TP214.TP 33.91,37.59 34.67,37.59 TP215.TP 36.45,37.59 37.21,37.59 TP216.TP
N$92
  Top 1.27: TP217.TP 31.37,40.13 32.13,40.13 TP218.TP 33.91,40.13 34.67,40.13 TP219.TP 36.45,40.13 37.21,40.13 TP220.TP
N$93
  Top 1.27: TP221.TP 31.37,42.67 32.13,42.67 TP222.TP 33.91,42.67 34.67,42.67 TP223.TP 36.45,42.67 37.21,42.67 TP224.TP
N$94
  Top 1.27: TP225.TP 31.37,45.21 32.13,45.21 TP226.TP 33.91,45.21 34.67,45.21 TP227.TP 36.45,45.21 37.21,45.21 TP228.TP
N$95
  Top 1.27: TP229.TP 31.37,47.75 32.13,47.75 TP230.TP 33.91,47.75 34.67,47.75 TP231.TP 36.45,47.75 37.21,47.75 TP232.TP
N$96
  Top 1.27: TP233.TP 31.37,50.29 32.13,50.29 TP234.TP 33.91,50.29 34.67,50.29 TP235.TP 36.45,50.29 37.21,50.29 TP236.TP
N$97
  Top 1.27: TP237.TP 31.37,52.83 32.13,52.83 TP238.TP 33.91,52.83 34.67,52.83 TP239.TP 36.45,52.83 37.21,52.83 TP240.TP
N$98
  Top 1.27: TP241.TP 46.61,35.05 47.37,35.05 TP242.TP 49.15,35.05 49.91,35.05 TP243.TP 51.69,35.05 52.45,35.05 TP244.TP
N$99
  Top 1.27: TP245.TP 46.61,37.59 47.37,37.59 TP246.TP 49.15,37.59 49.91,37.59 TP247.TP 51.69,37.59 52.45,37.59 TP248.TP
N$100
  Top 1.27: TP249.TP 46.61,40.13 47.37,40.13 TP250.TP 49.15,40.13 49.91,40.13 TP251.TP 51.69,40.13 52.45,40.13 TP252.TP
N$101
  Top 1.27: TP253.TP 46.61,42.67 47.37,42.67 TP254.TP 49.15,42.67 49.91,42.67 TP255.TP 51.69,42.67 52.45,42.67 TP256.TP
N$102
  Top 1.27: TP257.TP 46.61,45.21 47.37,45.21 TP258.TP 49.15,45.21 49.91,45.21 TP259.TP 51.69,45.21 52.45,45.21 TP260.TP
N$103
  Top 1.27: TP261.TP 46.61,47.75 47.37,47.75 TP262.TP 49.15,47.75 49.91,47.75 TP263.TP 51.69,47.75 52.45,47.75 TP264.TP
N$104
  Top 1.27: TP265.TP 46.61,50.29 47.37,50.29 TP266.TP 49.15,50.29 49.91,50.29 TP267.TP 51.69,50.29 52.45,50.29 TP268.TP
N$105
  Top 1.27: TP269.TP 46.61,52.83 47.37,52.83 TP270.TP 49.15,52.83 49.91,52.83 TP271.TP 51.69,52.83 52.45,52.83 TP272.TP
N$106
  Top 1.27: TP273.TP 59.31,35.05 60.07,35.05 TP274.TP 61.85,35.05 62.61,35.05 TP275.TP 64.39,35.05 65.15,35.05 TP276.TP
N$107
  Top 1.27: TP277.TP 59.31,37.59 60.07,37.59 TP278.TP 61.85,37.59 62.61,37.59 TP279.TP 64.39,37.59 65.15,37.59 TP280.TP
N$108
  Top 1.27: TP281.TP 59.31,40.13 60.07,40.13 TP282.TP 61.85,40.13 62.61,40.13 TP283.TP 64.39,40.13 65.15,40.13 TP284.TP
N$109
  Top 1.27: TP285.TP 59.31,42.67 60.07,42.67 TP286.TP 61.85,42.67 62.61,42.67 TP287.TP 64.39,42.67 65.15,42.67 TP288.TP
N$110
  Top 1.27: TP289.TP 59.31,45.21 60.07,45.21 TP290.TP 61.85,45.21 62.61,45.21 TP291.TP 64.39,45.21 65.15,45.21 TP292.TP
N$111
  Top 1.27: TP293.TP 59.31,47.75 60.07,47.75 TP294.TP 61.85,47.75 62.61,47.75 TP295.TP 64.39,47.75 65.15,47.75 TP296.TP
N$112
  Top 1.27: TP297.TP 59.31,50.29 60.07,50.29 TP298.TP 61.85,50.29 62.61,50.29 TP299.TP 64.39,50.29 65.15,50.29 TP300.TP
N$113
  Top 1.27: TP301.TP 59.31,52.83 60.07,52.83 TP302.TP 61.85,52.83 62.61,52.83 TP303.TP 64.39,52.83 65.15,52.83 TP304.TP
N$114
  Top 1.27: TP305.TP 74.55,35.05 75.31,35.05 TP306.TP 77.09,35.05 77.85,35.05 TP307.TP 79.63,35.05 80.39,35.05 TP308.TP
N$115
  Top 1.27: TP309.TP 74.55,37.59 75.31,37.59 TP310.TP 77.09,37.59 77.85,37.59 TP311.TP 79.63,37.59 80.39,37.59 TP312.TP
N$116
  Top 1.27: TP313.TP 74.55,40.13 75.31,40.13 TP314.TP 77.09,40.13 77.85,40.13 TP315.TP 79.63,40.13 80.39,40.13 TP316.TP
N$117
  Top 1.27: TP317.TP 74.55,42.67 75.31,42.67 TP318.TP 77.09,42.67 77.85,42.67 TP319.TP 79.63,42.67 80.39,42.67 TP320.TP
N$118
  Top 1.27: TP321.TP 74.55,45.21 75.31,45.21 TP322.TP 77.09,45.21 77.85,45.21 TP323.TP 79.63,45.21 80.39,45.21 TP324.TP
N$119
  Top 1.27: TP325.TP 74.55,47.75 75.31,47.75 TP326.TP 77.09,47.75 77.85,47.75 TP327.TP 79.63,47.75 80.39,47.75 TP328.TP
N$120
  Top 1.27: TP329.TP 74.55,50.29 75.31,50.29 TP330.TP 77.09,50.29 77.85,50.29 TP331.TP 79.63,50.29 80.39,50.29 TP332.TP
N$121
  Top 1.27: TP333.TP 74.55,52.83 75.31,52.83 TP334.TP 77.09,52.83 77.85,52.83 TP335.TP 79.63,52.83 80.39,52.83 TP336.TP
N$122
  Top 1.27: TP337.TP 87.25,35.05 88.01,35.05 TP338.TP 89.79,35.05 90.55,35.05 TP339.TP 92.33,35.05 93.09,35.05 TP340.TP
N$123
  Top 1.27: TP341.TP 87.25,37.59 88.01,37.59 TP342.TP 89.79,37.59 90.55,37.59 TP343.TP 92.33,37.59 93.09,37.59 TP344.TP
N$124
  Top 1.27: TP345.TP 87.25,40.13 88.01,40.13 TP346.TP 89.79,40.13 90.55,40.13 TP347.TP 92.33,40.13 93.09,40.13 TP348.TP
N$125
  Top 1.27: TP349.TP 87.25,42.67 88.01,42.67 TP350.TP 89.79,42.67 90.55,42.67 TP351.TP 92.33,42.67 93.09,42.67 TP352.TP
N$126
  Top 1.27: TP353.TP 87.25,45.21 88.01,45.21 TP354.TP 89.79,45.21 90.55,45.21 TP355.TP 92.33,45.21 93.09,45.21 TP356.TP
N$127
  Top 1.27: TP357.TP 87.25,47.75 88.01,47.75 TP358.TP 89.79,47.75 90.55,47.75 TP359.TP 92.33,47.75 93.09,47.75 TP360.TP
N$128
  Top 1.27: TP361.TP 87.25,50.29 88.01,50.29 TP362.TP 89.79,50.29 90.55,50.29 TP363.TP 92.33,50.29 93.09,50.29 TP364.TP
N$129
  Top 1.27: TP365.TP 87.25,52.83 88.01,52.83 TP366.TP 89.79,52.83 90.55,52.83 TP367.TP 92.33,52.83 93.09,52.83 TP368.TP
N$130
  Top 1.27: TP369.TP 102.49,35.05 103.25,35.05 TP370.TP 105.03,35.05 105.79,35.05 TP371.TP 107.57,35.05 108.33,35.05 TP372.TP
N$131
  Top 1.27: TP373.TP 102.49,37.59 103.25,37.59 TP374.TP 105.03,37.59 105.79,37.59 TP375.TP 107.57,37.59 108.33,37.59 TP376.TP
N$132
  Top 1.27: TP377.TP 102.49,40.13 103.25,40.13 TP378.TP 105.03,40.13 105.79,40.13 TP379.TP 107.57,40.13 108.33,40.13 TP380.TP
N$133
  Top 1.27: TP381.TP 102.49,42.67 103.25,42.67 TP382.TP 105.03,42.67 105.79,42.67 TP383.TP 107.57,42.67 108.33,42.67 TP384.TP
N$134
  Top 1.27: TP385.TP 102.49,45.21 103.25,45.21 TP386.TP 105.03,45.21 105.79,45.21 TP387.TP 107.57,45.21 108.33,45.21 TP388.TP
N$135
  Top 1.27: TP389.TP 102.49,47.75 103.25,47.75 TP390.TP 105.03,47.75 105.79,47.75 TP391.TP 107.57,47.75 108.33,47.75 TP392.TP 110.11,47.75 110.62,47.75 115.95,42.42 TP472.TP 116.33,41.02 116.33,40.26 TP473.TP
N$136
  Top 1.27: TP393.TP 102.49,50.29 103.25,50.29 TP394.TP 105.03,50.29 105.79,50.29 TP395.TP 107.57,50.29 108.33,50.29 TP396.TP 110.11,50.29 114.43,50.29 115.95,48.77 TP470.TP 116.33,47.37 116.33,46.61 TP471.TP
N$137
  Top 1.27: TP397.TP 102.49,52.83 103.25,52.83 TP398.TP 105.03,52.83 105.79,52.83 TP399.TP 107.57,52.83 108.33,52.83 TP400.TP
N$138
  Top 1.27: TP401.TP 28.83,55.37 32.13,55.37 TP402.TP 40.64,55.88 40.64,5.08 TP403.TP 46.61,4.57 49.91,4.57 TP404.TP 51.69,4.57 60.07,4.57 TP405.TP 61.85,4.57 65.15,4.57 TP406.TP 66.93,4.57 68.2,4.57 | 68.2,4.57 75.31,4.57 TP407.TP 77.09,4.57 77.85,4.57 TP408.TP 79.63,4.57 80.01,5.08 96.52,5.08 96.52,53.34 | 68.58,53.34 68.58,5.08 68.2,4.57
N$139
  Top 1.27: TP430.TP 31.37,29.97 32.13,29.97 TP431.TP 33.91,29.97 34.67,29.97 TP432.TP 36.45,29.97 37.21,29.97 TP433.TP
N$140
  Top 1.27: TP434.TP 46.61,29.97 47.37,29.97 TP435.TP 49.15,29.97 49.91,29.97 TP436.TP 51.69,29.97 52.45,29.97 TP437.TP
N$141
  Top 1.27: TP438.TP 59.31,29.97 60.07,29.97 TP439.TP 61.85,29.97 62.61,29.97 TP440.TP 64.39,29.97 65.15,29.97 TP441.TP
N$142
  Top 1.27: TP442.TP 74.55,29.97 75.31,29.97 TP443.TP 77.09,29.97 77.85,29.97 TP444.TP 79.63,29.97 80.39,29.97 TP445.TP
N$143
  Top 1.27: TP409.TP 31.37,2.03 32.13,2.03 TP410.TP 33.91,2.03 34.67,2.03 TP411.TP
N$144
  Top 1.27: TP412.TP 42.8,2.03 43.56,2.03 TP413.TP 45.34,2.03 46.1,2.03 TP414.TP
N$145
  Top 1.27: TP415.TP 54.23,2.03 54.99,2.03 TP416.TP 56.77,2.03 57.53,2.03 TP417.TP
N$146
  Top 1.27: TP418.TP 64.39,2.03 65.15,2.03 TP419.TP 66.93,2.03 67.69,2.03 TP420.TP
N$147
  Top 1.27: TP421.TP 74.55,2.03 75.31,2.03 TP422.TP 77.09,2.03 77.85,2.03 TP423.TP 79.63,2.03 90.55,2.03 TP424.TP
N$148
  Top 1.27: TP425.TP 107.57,2.03 108.33,2.03 TP426.TP 110.11,2.03 110.87,2.03 TP427.TP 112.65,2.03 113.41,2.03 TP428.TP 115.19,2.03 115.95,2.03 TP429.TP
N$149
  Top 1.27: TP446.TP 87.25,29.97 88.01,29.97 TP447.TP 89.79,29.97 90.55,29.97 TP448.TP 92.33,29.97 93.09,29.97 TP449.TP
N$150
  Top 1.27: TP450.TP 102.49,29.97 103.25,29.97 TP451.TP 105.03,29.97 105.79,29.97 TP452.TP 107.57,29.97 108.33,29.97 TP453.TP
N$151
  Top 1.27: TP454.TP 110.11,55.37 110.36,55.12 115.95,55.12 TP455.TP 116.33,53.72 116.33,52.96 TP456.TP
N$152
  Top 1.27: TP459.TP 112.52,37.72 112.52,38.48 TP458.TP 112.52,40.26 112.52,41.02 TP457.TP
N$153
  Top 1.27: TP462.TP 112.52,19.94 112.52,20.7 TP461.TP 112.52,22.48 112.52,23.24 TP460.TP
N$154
  Top 1.27: TP463.TP 115.7,5.08 TP464.TP 116.33,7.24 116.33,8 TP465.TP

## Text on the board
Bottom: 11-DE-7 | DOUGLAS ELECTRONICS